# EAGLE design Adafruit Circuit Playground TFT Gizmo (EAGLE 9.5.0)
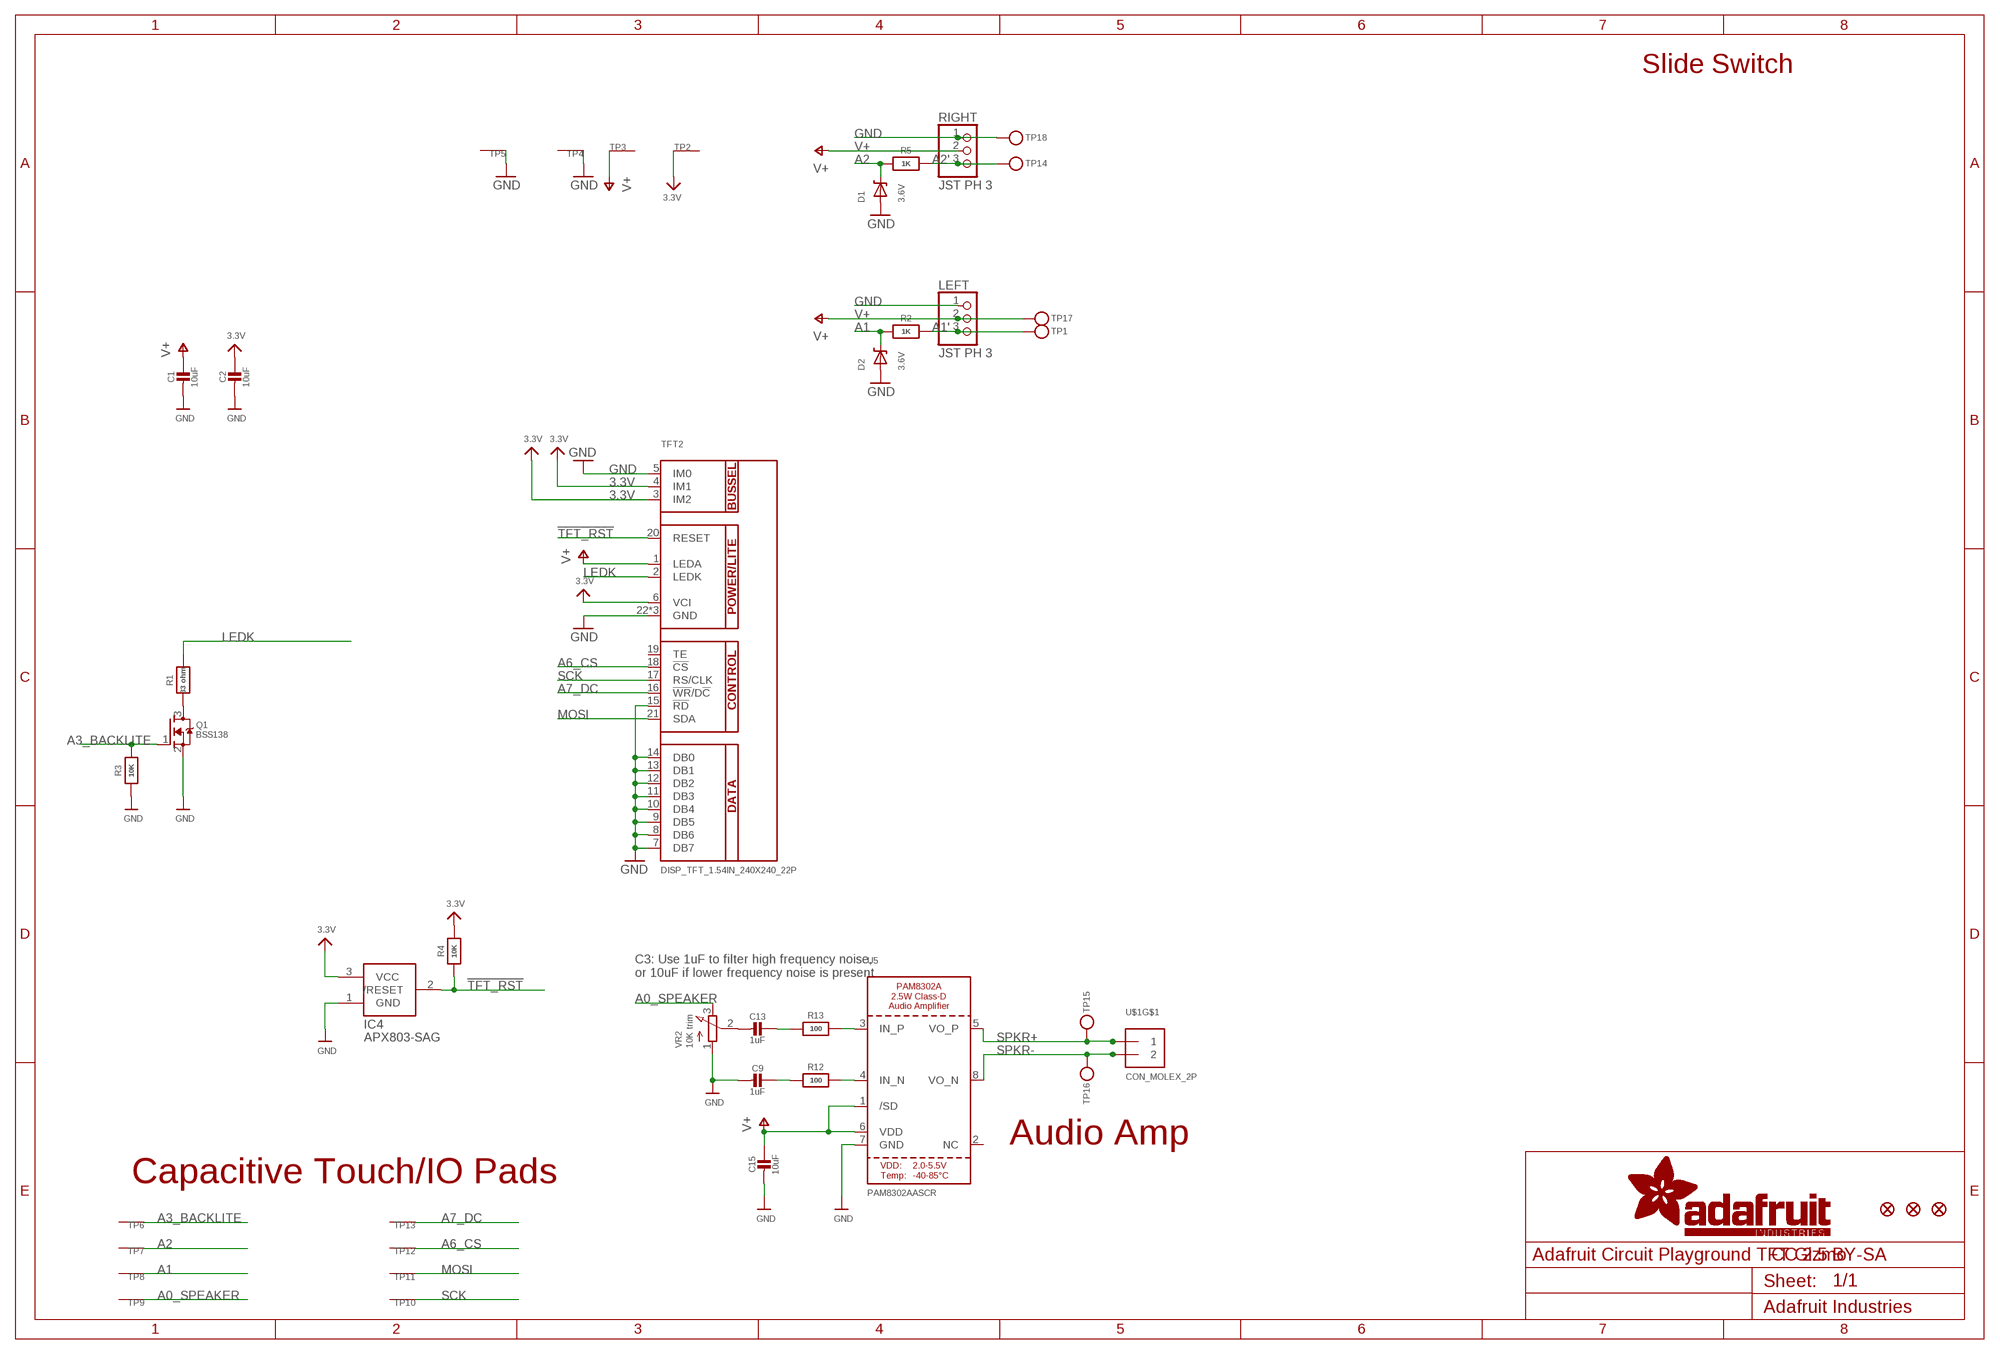
[diagram p0: schematic, sheet 1]

## Parts
C1  10uF  CAP_CERAMIC0805-NOOUTLINE  [0805-NO]
C2  10uF  CAP_CERAMIC0805-NOOUTLINE  [0805-NO]
C9  1uF  CAP_CERAMIC0603_NO  [0603-NO]
C13  1uF  CAP_CERAMIC0603_NO  [0603-NO]
C15  10uF  CAP_CERAMIC0805-NOOUTLINE  [0805-NO]
D1  3.6V  DIODE-ZENERSOD323  [SOD-323]
D2  3.6V  DIODE-ZENERSOD323  [SOD-323]
IC4  APX803-SAG  AXP083-SAG  [SOT23]
LEFT  JST PH 3  CON_JST_PH_3PIN  [JSTPH3]
Q1  BSS138  MOSFET-NWIDE  [SOT23-WIDE]
R1  33 ohm  RESISTOR_0603_NOOUT  [0603-NO]
R2  1K  RESISTOR_0603_NOOUT  [0603-NO]
R3  10K  RESISTOR_0603_NOOUT  [0603-NO]
R4  10K  RESISTOR_0603_NOOUT  [0603-NO]
R5  1K  RESISTOR_0603_NOOUT  [0603-NO]
R12  100  RESISTOR_0603_NOOUT  [0603-NO]
R13  100  RESISTOR_0603_NOOUT  [0603-NO]
RIGHT  JST PH 3  CON_JST_PH_3PIN  [JSTPH3]
TFT2  DISP_TFT_1.54IN_240X240_22P  [TFT_1.54IN_240X240_22PIN]
TP1  TESTPOINTROUND1.5MMNO  [TESTPOINT_ROUND_1.5MM_NO]
TP2  SEWTAP_SMTNUTM3  [SMT_NUT_3MM]
TP3  SEWTAP_SMTNUTM3  [SMT_NUT_3MM]
TP4  SEWTAP_SMTNUTM3  [SMT_NUT_3MM]
TP5  SEWTAP_SMTNUTM3  [SMT_NUT_3MM]
TP6  SEWTAP_SMTNUTM3  [SMT_NUT_3MM]
TP7  SEWTAP_SMTNUTM3  [SMT_NUT_3MM]
TP8  SEWTAP_SMTNUTM3  [SMT_NUT_3MM]
TP9  SEWTAP_SMTNUTM3  [SMT_NUT_3MM]
TP10  SEWTAP_SMTNUTM3  [SMT_NUT_3MM]
TP11  SEWTAP_SMTNUTM3  [SMT_NUT_3MM]
TP12  SEWTAP_SMTNUTM3  [SMT_NUT_3MM]
TP13  SEWTAP_SMTNUTM3  [SMT_NUT_3MM]
TP14  TESTPOINTROUND1.5MMNO  [TESTPOINT_ROUND_1.5MM_NO]
TP15  TESTPOINTROUND1.5MMNO  [TESTPOINT_ROUND_1.5MM_NO]
TP16  TESTPOINTROUND1.5MMNO  [TESTPOINT_ROUND_1.5MM_NO]
TP17  TESTPOINTROUND1.5MMNO  [TESTPOINT_ROUND_1.5MM_NO]
TP18  TESTPOINTROUND1.5MMNO  [TESTPOINT_ROUND_1.5MM_NO]
U5  PAM8302AASCR  AUDIOAMP_PAM8302A  [MSOP8_0.65MM]
U$1  CON_MOLEX_2P  [53398-0271]
U$2  FIDUCIAL_1MM  [FIDUCIAL_1MM]
U$3  FIDUCIAL_1MM  [FIDUCIAL_1MM]
U$6  FIDUCIAL_1MM  [FIDUCIAL_1MM]
VR2  10K trim  TRIMPOT3303W/X  [TRIMPOT_BOURNS_3303W]

## Nets
3.3V: C2.1 IC4.3(VCC) R4.2 TFT2.3(IM2) TFT2.4(IM1) TFT2.6(VCI) TP2.P$1(SEW)
!TFT_RST: IC4.2(/RESET) R4.1 TFT2.20(RESET)
A0_SPEAKER: TP9.P$1(SEW) VR2.3(E)
A1: D2.C R2.2 TP8.P$1(SEW)
A1': LEFT.3 R2.1 TP1.P$1
A2: D1.C R5.2 TP7.P$1(SEW)
A2': R5.1 RIGHT.3 TP14.P$1
A3_BACKLITE: Q1.1(G) R3.2 TP6.P$1(SEW)
A6_CS: TFT2.18(!CS) TP12.P$1(SEW)
A7_DC: TFT2.16(!WR!/D!C) TP13.P$1(SEW)
GND: C1.2 C2.2 C9.2 C15.2 D1.A D2.A IC4.1(GND) LEFT.1 Q1.2(S) R3.1 RIGHT.1 TFT2.5(IM0) TFT2.7(DB7) TFT2.8(DB6) TFT2.9(DB5) TFT2.10(DB4) TFT2.11(DB3) TFT2.12(DB2) TFT2.13(DB1) TFT2.14(DB0) TFT2.15(!RD) TFT2.22(GND) TFT2.SUPPORT1(GND) TFT2.SUPPORT2(GND) TP4.P$1(SEW) TP5.P$1(SEW) TP18.P$1 U5.7(GND) VR2.1(A)
LEDK: R1.2 TFT2.2(LEDK)
MOSI: TFT2.21(SDA) TP11.P$1(SEW)
N$1: Q1.3(D) R1.1
N$19: R12.2 U5.4(IN_N)
N$20: R13.2 U5.3(IN_P)
N$21: C9.1 R12.1
N$22: C13.1 R13.1
N$23: C13.2 VR2.2(S)
SCK: TFT2.17(RS/CLK) TP10.P$1(SEW)
SPKR+: TP15.P$1 U5.5(VO_P) U$1.1
SPKR-: TP16.P$1 U5.8(VO_N) U$1.2
V+ [thickpower]: C1.1 C15.1 LEFT.2 RIGHT.2 TFT2.1(LEDA) TP3.P$1(SEW) TP17.P$1 U5.1(/SD) U5.6(VDD)
Unconnected: TFT2.19(TE) U5.2(NC) U$1.M1(MT) U$1.M2(MT)

## Notes on the sheet
- Slide Switch
- C3: Use 1uF to filter high frequency noise,
  or 10uF if lower frequency noise is present
- Audio Amp
- Capacitive Touch/IO Pads
- CC 2.5 BY-SA

## Library data of the parts
C1 C2 C9 C13 C15 = microbuilder:CAP_CERAMIC: Ceramic Capacitors For new designs, use the packages preceded by an '_' character since they are more reliable: The following footprints should be used on most boards: _0402 - Standard footprint for regular board layouts _0603 - Standard footprint for regular board layouts _0805 - Standard footprint for regular board layouts _1206 - Standard footprint for regular board layouts For extremely tight-pitch boards where space is at a premium, the following 'micro-pitch' footprints can be used (smaller pads, no silkscreen outline, etc.): _0402MP - Micro-pitch footprint for very dense/compact boards _0603MP - Micro-pitch footprint for very dense/compact boards _0805MP - Micro-pitch footprint for very dense/compact boards _1206MP - Micro-pitch footprint for very dense/compact boards
D1 D2 = microbuilder:DIODE-ZENER: Zener Diode SMA: 30V 1W Zener Diode, 1.2Vf - Digikey: SMAZ30-FDICT-ND
IC4 = adafruit:AXP083
LEFT RIGHT = microbuilder:CON_JST_PH_3PIN
Q1 = microbuilder:MOSFET-N: N-Channel Mosfet LEGEND VDS: Voltage Drain-Source ID: Drain Current RDS(ON): Drain-Source On-State Resistance VGS(TH): Gate-Source Threshold Voltage CISS: Drain-Source Input Capacitance SOT-23 Name VDS ID RDS(ON) VGS(TH) CISS Order Number 2N7002E 60V 260mA 2.5 Ohm 2.5V @ 250uA 26.7pF @ 25V 2N7002ET1GOSTR-ND BSH103 30V 850mA 400 mOhm 400mV @ 1mA 83pF @ 24V BSH103,235-ND BSS138 60V 320mA 1.6 Ohm 1.5V @ 250uA 50pF @ 10V Mouser: 771-BSS138PW115 DMN2075U-7 20V 4.2A 38 mOhm 1V @ 250 uA 594.3pF @ 10V DMN2075U-7DICT-ND * BSS138 good choice for I2C level-shifting POWERPAK 1212-8 Name VDS ID RDS(ON) VGS(TH) CISS Order Number Si7308DN 60V 6A 58 mOhm 3V @ 250uA 665pF @ 15V SI7308DN-T1-E3CT-ND
R1-R5 R12 R13 = microbuilder:RESISTOR: Resistors For new designs, use the packages preceded by an '_' character since they are more reliable: The following footprints should be used on most boards: _0402 - Standard footprint for regular board layouts _0603 - Standard footprint for regular board layouts _0805 - Standard footprint for regular board layouts _1206 - Standard footprint for regular board layouts For extremely tight-pitch boards where space is at a premium, the following 'micro-pitch' footprints can be used (smaller pads, no silkscreen outline, etc.): _0402MP - Micro-pitch footprint for very dense/compact boards _0603MP - Micro-pitch footprint for very dense/compact boards _0805MP - Micro-pitch footprint for very dense/compact boards _1206MP - Micro-pitch footprint for very dense/compact boards
TFT2 = microbuilder:DISP_TFT_1.54IN_240X240_22P
TP1 TP14-TP18 = microbuilder:TESTPOINT: Test Point Various test points for characterisation and PCB testing TESTPOINT_SMT - Compact Surface Mount Test Point [Digikey: 5016KTR-ND]
TP2-TP13 = microbuilder:SEWTAP
U5 = microbuilder:AUDIOAMP_PAM8302A: PAM8302A - 2.5W Class-D Mono Audio Amplifier MSOP8 = PAM8302AASCR
U$1 = microbuilder:CON_MOLEX_2P
U$2 U$3 U$6 = microbuilder:FIDUCIAL: Fiducial Alignment Points Various fiducial points for machine vision alignment.; BOM: EXCLUDE
VR2 = microbuilder:TRIMPOT: 3-Pin SMT Trimpots Bourns TC33 (X-2) Series 1K - Digikey: TC33X-102ECT-ND 10K - Digikey: TC33X-2-103E 100K - Digikey: TC33X-104ECT-ND Bourns 3303 (W) Series 3mm 10K Single Turn - Digikey: 3303W-103ETR-ND 3mm 100K Single Turn - Digikey: 3303X-104ETR-ND

## Net classes
1 power: width 0.254 mm
2 thickpower: width 0.406 mm

## Board
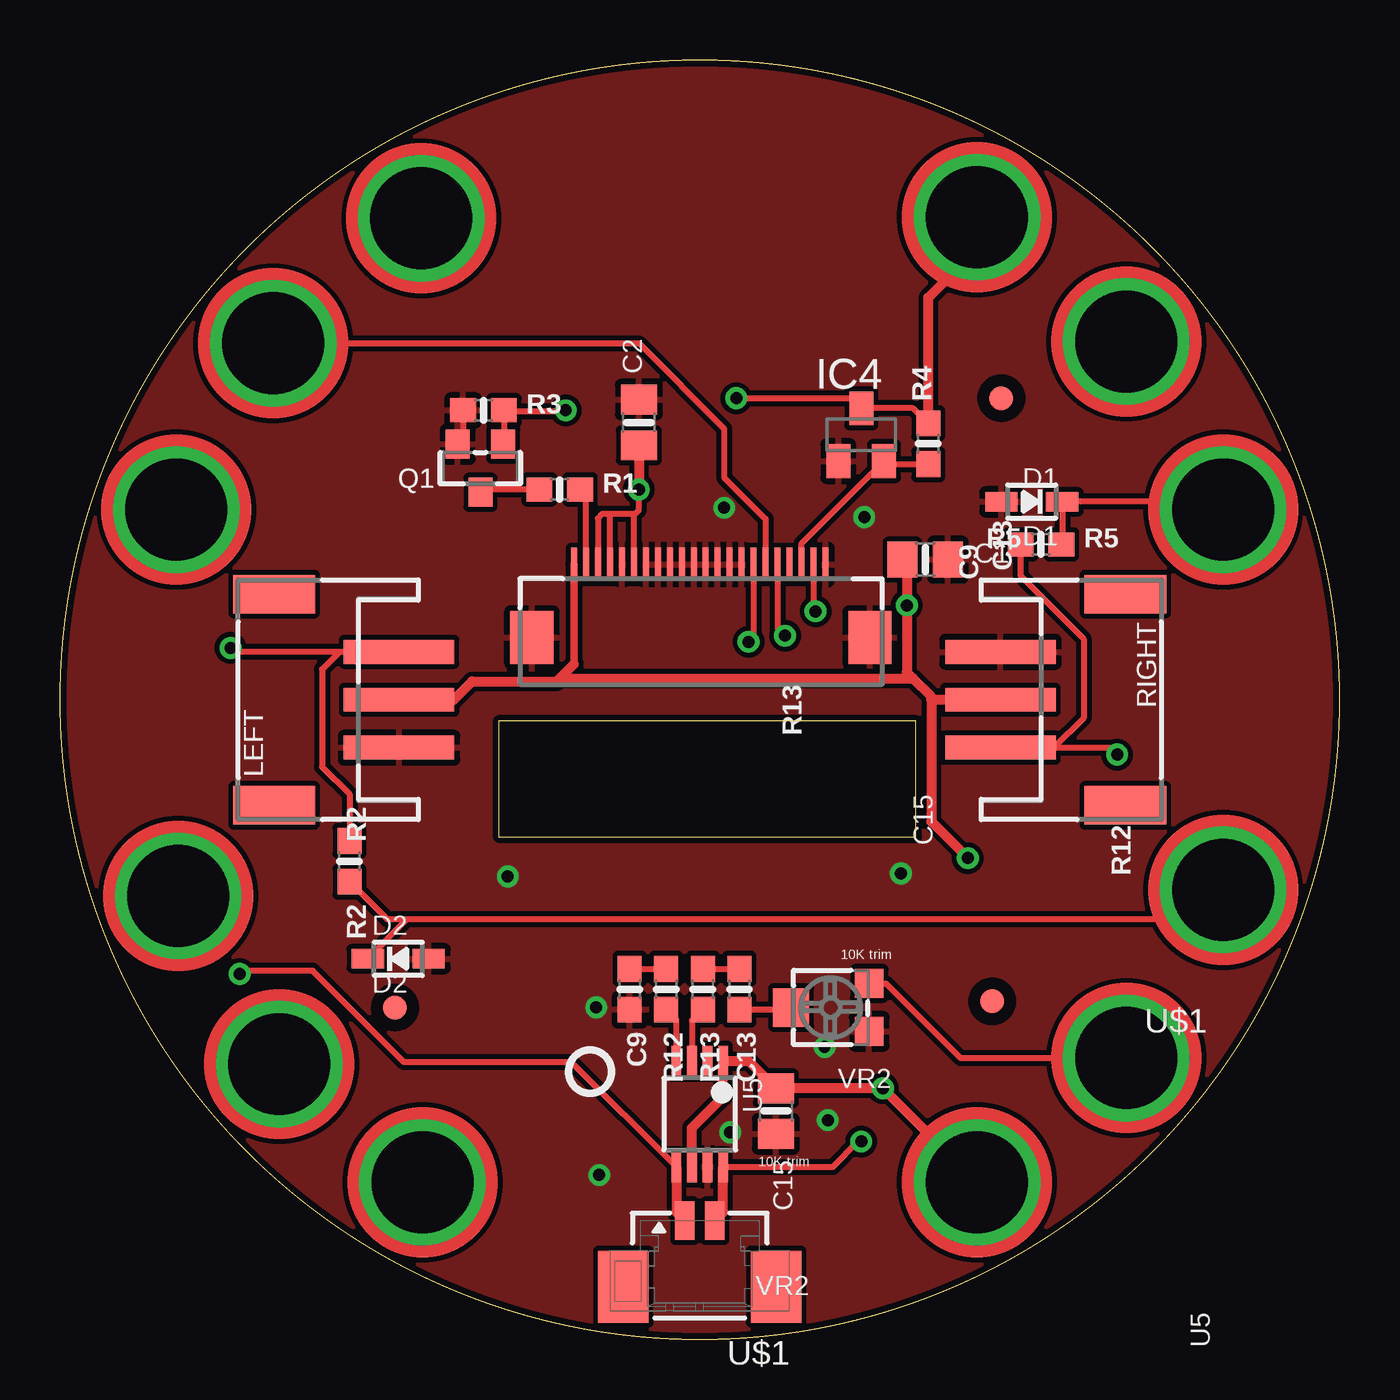
[diagram p1: board, top side]
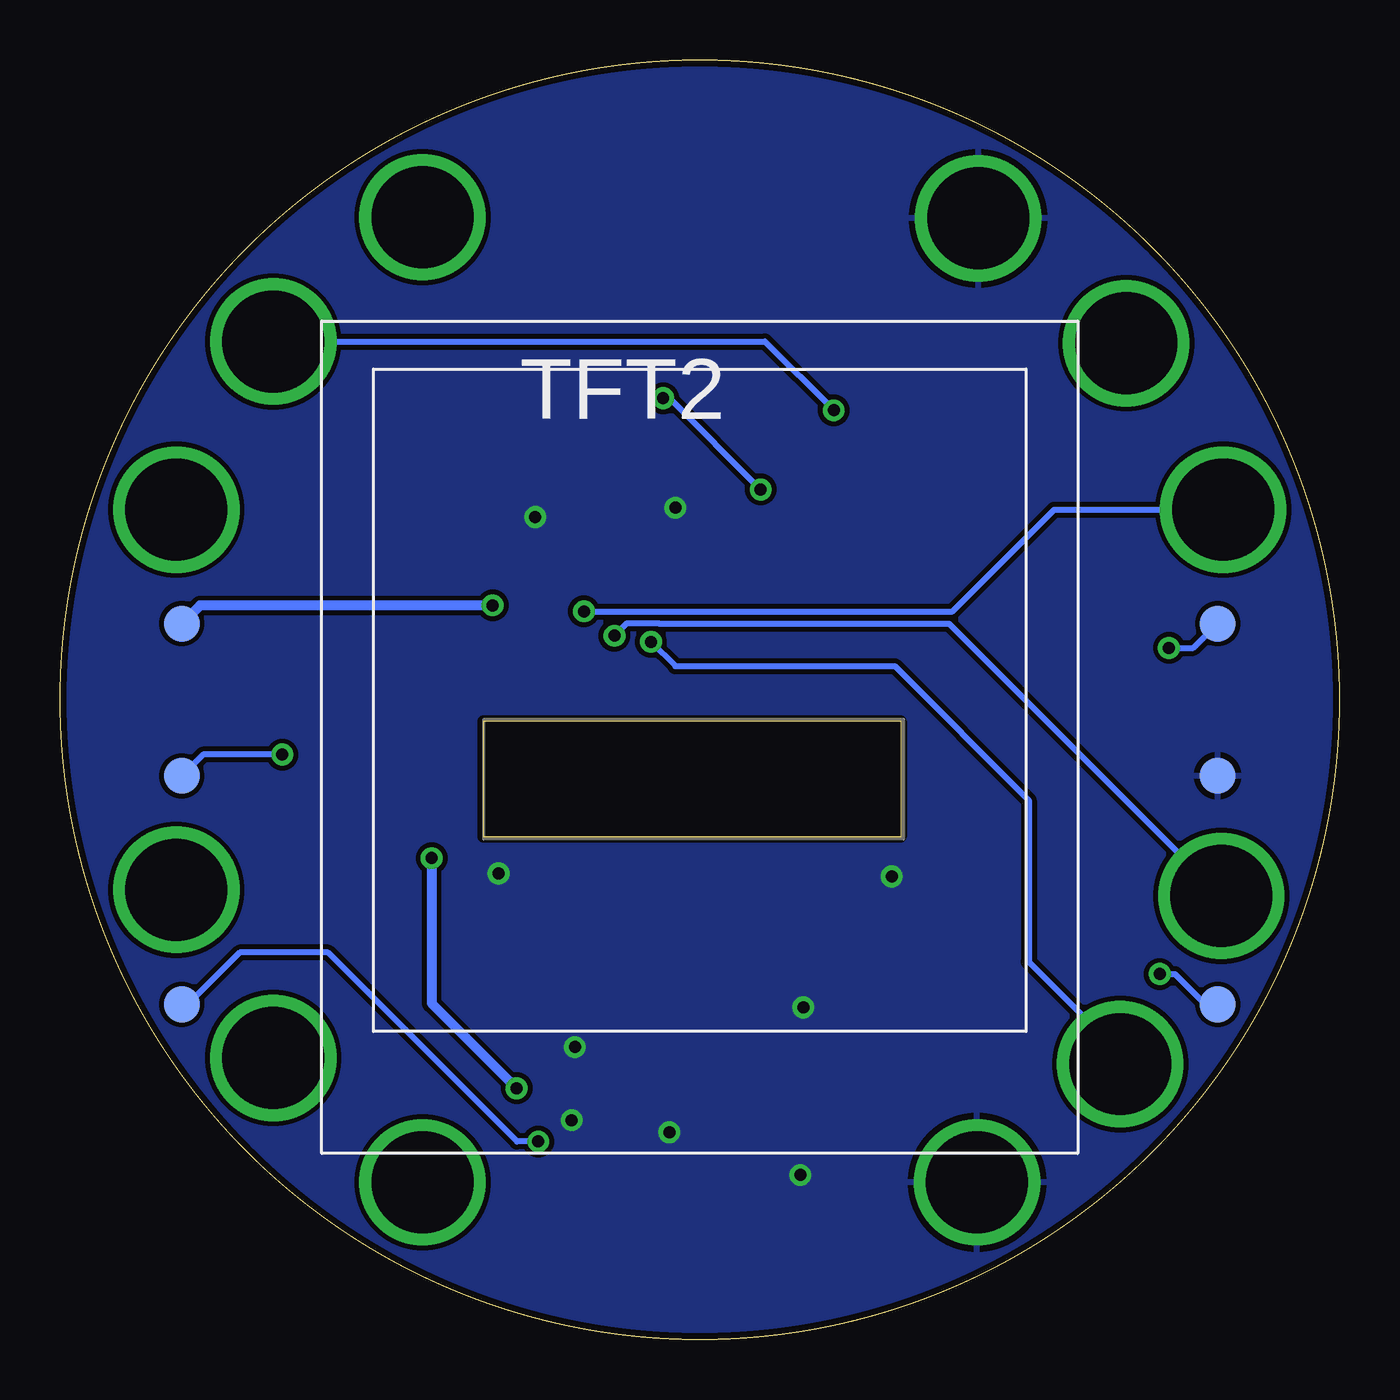
[diagram p2: board, bottom side, seen from below]

Size 53.34 x 53.34 mm. Coordinates in mm from the lower left corner, seen from the top.
Outline: 35.69,25.78 18.29,25.78 18.29,20.96 35.69,20.96 35.69,25.78
Outline: circle at 26.67,26.67 radius 26.67
Copper layers (1*16): Top 0.035mm / dielectric 1.5mm / Bottom 0.035mm
Design rules "adafruit *": minimum track width 8mil, minimum drill 15.5mil, track to track 8mil, track to pad 7mil, pad to pad 8mil, via to via 8mil, smd to smd 8mil, copper to edge 10mil, drill to drill 8mil, minimum pad ring 10mil, minimum via ring 8mil, stop-mask expansion 2mil, vias tented up to drill 20mil, thermal gap 10mil

### Footprints (pad centres in the part's own frame; a part is rotated, then mirrored left to right if it is on the bottom)
0805-NO = smd 1.24 x 1.5: 1 -0.95,0; 2 0.95,0
0603-NO = smd 1.075 x 1: 1 -0.85,0; 2 0.85,0
SOD-323 = smd 1.35 x 0.8: A 1.27,0; C -1.27,0
SOT23 = smd 1 x 1.4: 1 -0.95,-1.1; 2 0.95,-1.1; 3 0,1.1
JSTPH3 = smd 1 x 4.6: 1 -2,-2.7; 2 0,-2.7; 3 2,-2.7 | smd 1.6 x 3.4: NC1 -4.4,2.5; NC2 4.4,2.5
SOT23-WIDE = smd 1 x 1.2: 1 -0.95,-1; 2 0.95,-1; 3 0,1
TFT_1.54IN_240X240_22PIN = smd 0.25 x 1.4 bottom: 1 5.25,2.722; 2 4.75,2.722; 3 4.25,2.722; 4 3.75,2.722; 5 3.25,2.722; 6 2.75,2.722; 7 2.25,2.722; 8 1.75,2.722; 9 1.25,2.722; 10 0.75,2.722; 11 0.25,2.722; 12 -0.25,2.722; 13 -0.75,2.722; 14 -1.25,2.722; 15 -1.75,2.722; 16 -2.25,2.722; 17 -2.75,2.722; 18 -3.25,2.722; 19 -3.75,2.722; 20 -4.25,2.722; 21 -4.75,2.722; 22 -5.25,2.722 | smd 1.8 x 2.2 bottom: SUPPORT1 7,-0.328; SUPPORT2 -7.1,-0.328
TESTPOINT_ROUND_1.5MM_NO = smd 1.5 x 1.5: P$1 0,0
SMT_NUT_3MM = drill 4.25 pad 4.572: P$1 0,0
MSOP8_0.65MM = smd 0.4 x 1.3: 1 -0.975,-2.2; 2 -0.325,-2.2; 3 0.325,-2.2; 4 0.975,-2.2; 5 0.975,2.2; 6 0.325,2.2; 7 -0.325,2.2; 8 -0.975,2.2
53398-0271 = smd 0.8 x 1.6: 1 0.625,-1.27; 2 -0.625,-1.27 | smd 2.1 x 3: M1 3.185,1.48; M2 -3.185,1.48
FIDUCIAL_1MM = smd 1 x 1: 1 0,0
TRIMPOT_BOURNS_3303W = smd 1.2 x 1.2: 1 -1,-1.6; 3 1,-1.6 | smd 1.6 x 1.5: 2 0,1.65

### Placement (x,y rotation side)
C1  36.07,32.51 0 top
C2  24.13,38.23 90 top
C9  23.75,14.61 270 top
C13  28.32,14.61 270 top
C15  29.85,9.53 270 top
D1  40.51,34.93 180 top
D2  14.1,15.88 0 top
IC4  33.4,37.72 0 top
LEFT  11.43,26.67 90 top
Q1  17.53,36.32 180 top
R1  20.83,35.43 0 top
R2  12.07,19.94 270 top
R3  17.65,38.73 0 top
R4  36.2,37.34 90 top
R5  40.89,33.15 0 top
R12  25.27,14.61 270 top
R13  26.8,14.61 270 top
RIGHT  41.91,26.67 270 top
TFT2  26.67,29.59 0 bottom
TP1  5.08,29.85 0 bottom
TP2  38.23,46.79 90 top
TP3  38.23,6.55 90 top
TP4  15.06,46.74 90 top
TP5  15.11,6.55 90 top
TP6  44.45,41.61 90 top
TP7  48.49,34.59 90 top
TP8  48.49,18.75 90 top
TP9  44.45,11.73 90 top
TP10  8.89,41.53 90 top
TP11  4.85,34.59 90 top
TP12  4.93,18.49 90 top
TP13  9.14,11.48 90 top
TP14  48.26,23.5 0 bottom
TP15  5.08,13.97 0 bottom
TP16  48.26,13.97 0 bottom
TP17  48.26,29.85 0 bottom
TP18  5.08,23.5 0 bottom
U5  26.67,9.4 180 top
U$1  26.67,3.68 180 top
U$2  39.24,39.24 0 top
U$3  13.97,13.84 0 top
U$6  38.86,14.1 0 top
U$7  [PCBFEAT-REV-040]  22.1,11.18 0 top
U$17  [TFTGIZMO_FRONT]  53.34,0 0 bottom
U$18  [TFTGIZMO_BACK]  0,0 0 top
VR2  32.13,13.84 90 top

### Tracks (layer width: path | path; a pad name or v marks a point on that pad's centre or on a via)
3.3V  (via drill 0.5)
  Top 0.254: R4.2 35.56,38.82 IC4.3 32.98,39.24 v28.19,39.24 | TFT2.6 23.92,34.37 | 23.92,34.37 23.88,34.42 22.86,34.42 | 22.86,34.42 22.61,34.42 22.42,34.23 TFT2.3 | TFT2.4 22.92,34.36 22.86,34.42 | 23.92,34.37 24.13,34.58 v24.13,35.43
  Top 0.406: R4.2 36.2,43.43 38.23,45.47 TP2.P$1 | C2.1 v24.13,35.43
  Bottom 0.254: v24.13,35.43 27.94,39.24 v28.19,39.24
!TFT_RST
  Top 0.254: TFT2.20 30.92,33.19 IC4.2 34.48,36.49 R4.1
A0_SPEAKER
  Top 0.254: VR2.3 34.43,14.84 37.54,11.74 TP9.P$1
A1
  Top 0.254: TP8.P$1 47.27,17.53 14.48,17.53 | D2.C 14.48,17.53 | R2.2 13.63,17.53 14.48,17.53
A1'  (via drill 0.5)
  Top 0.254: R2.1 12.07,22.73 10.92,23.88 10.92,27.94 11.65,28.67 LEFT.3 7.27,28.67 v7.11,28.83
  Bottom 0.254: v7.11,28.83 6.1,28.83 TP1.P$1
A2
  Top 0.254: TP7.P$1 48.49,34.93 D1.C 41.78,33.15 R5.2
A2'  (via drill 0.5)
  Top 0.254: R5.1 40.04,31.84 42.67,29.21 42.67,25.91 41.43,24.67 RIGHT.3 43.78,24.67 v44.07,24.38
  Bottom 0.254: TP14.P$1 47.37,24.38 v44.07,24.38
A3_BACKLITE  (via drill 0.5)
  Top 0.254: Q1.1 18.5,37.35 R3.2 18.55,38.68 21.03,38.68 v21.08,38.73
  Bottom 0.254: TP6.P$1 23.95,41.61 v21.08,38.73
A6_CS  (via drill 0.5)
  Top 0.254: TFT2.18 29.92,29.64 v30.23,29.34
  Bottom 0.254: v30.23,29.34 29.7,29.87 28.38,29.87 28.36,29.85 16.28,29.85 TP12.P$1
A7_DC  (via drill 0.5)
  Top 0.254: TFT2.16 28.92,29.3 v28.7,29.08
  Bottom 0.254: v28.7,29.08 27.69,28.07 18.54,28.07 12.95,22.48 12.95,15.75 9.14,11.94 TP13.P$1
GND  (via drill 0.5)
  Top 0.254: R3.1 16.8,37.55 Q1.2
  other vias: 33.53,34.29 27.69,34.67 22.48,6.86 32,9.14 31.88,12.19 22.35,13.84 18.67,19.3 35.05,19.43 27.94,8.64
  pour Bottom: 53.34,53.34 0,53.34 0,0 53.34,0
  pour Top: 53.34,53.34 0,53.34 0,0 53.34,0
LEDK
  Top 0.254: TFT2.2 21.92,35.19 R1.2
MOSI  (via drill 0.5)
  Top 0.254: TFT2.21 31.42,30.43 v31.5,30.35
  Bottom 0.254: v31.5,30.35 16.13,30.35 11.89,34.59 TP11.P$1
N$1
  Top 0.254: R1.1 17.64,35.43 Q1.3
N$19
  Top 0.254: U5.4 25.7,13.33 R12.2
N$20
  Top 0.254: R13.2 26.35,13.3 U5.3
N$21
  Top 0.254: C9.1 R12.1
N$22
  Top 0.254: R13.1 C13.1
N$23
  Top 0.254: C13.2 30.39,13.76 VR2.2
SCK
  Top 0.254: TP10.P$1 24.13,41.53 27.69,37.97 27.69,35.94 29.42,34.21 TFT2.17
SPKR+  (via drill 0.5)
  Top 0.254: U5.5 21.34,11.56 14.35,11.56 10.54,15.37 7.62,15.37 v7.49,15.24
  Top 0.406: U5.5 25.7,5.3 U$1.1
  Bottom 0.254: v7.49,15.24 6.86,15.24 5.59,13.97 TP15.P$1
SPKR-  (via drill 0.5)
  Top 0.254: U5.8 32.22,7.2 33.27,8.26 v33.4,8.26
  Top 0.406: U5.8 27.65,5.3 U$1.2
  Bottom 0.254: v33.4,8.26 34.29,8.26 42.16,16.13 45.85,16.13 48.01,13.97 TP16.P$1
V+  (via drill 0.5)
  Top 0.305: TFT2.1 21.42,28.15
  Top 0.406: RIGHT.2 36.32,26.67 | LEFT.2 16.42,26.67 17.18,27.43 20.7,27.43 20.83,27.56 | 20.83,27.56 35.56,27.56 | 21.42,28.15 20.83,27.56 | U5.6 26.35,8.82 27.65,10.12 U5.1 28.72,11.6 C15.1 v34.3,10.48 TP3.P$1 | 36.32,26.67 36.32,21.59 v37.85,20.07 | C1.1 35.31,32.32 v35.31,30.61 35.31,27.81 35.56,27.56 | 36.32,26.67 36.32,26.8 35.56,27.56
  Bottom 0.406: v35.31,30.61 47.5,30.61 TP17.P$1 | v37.85,20.07 37.85,14.02 v34.3,10.48

### Text on the board
bDocu: ~D13 | ~D10/A3 | A4/D3 | ~D9/A2 | A5/D2 | ~D6/A1 | A6/D0~ | A7/D1~ | D12/A0